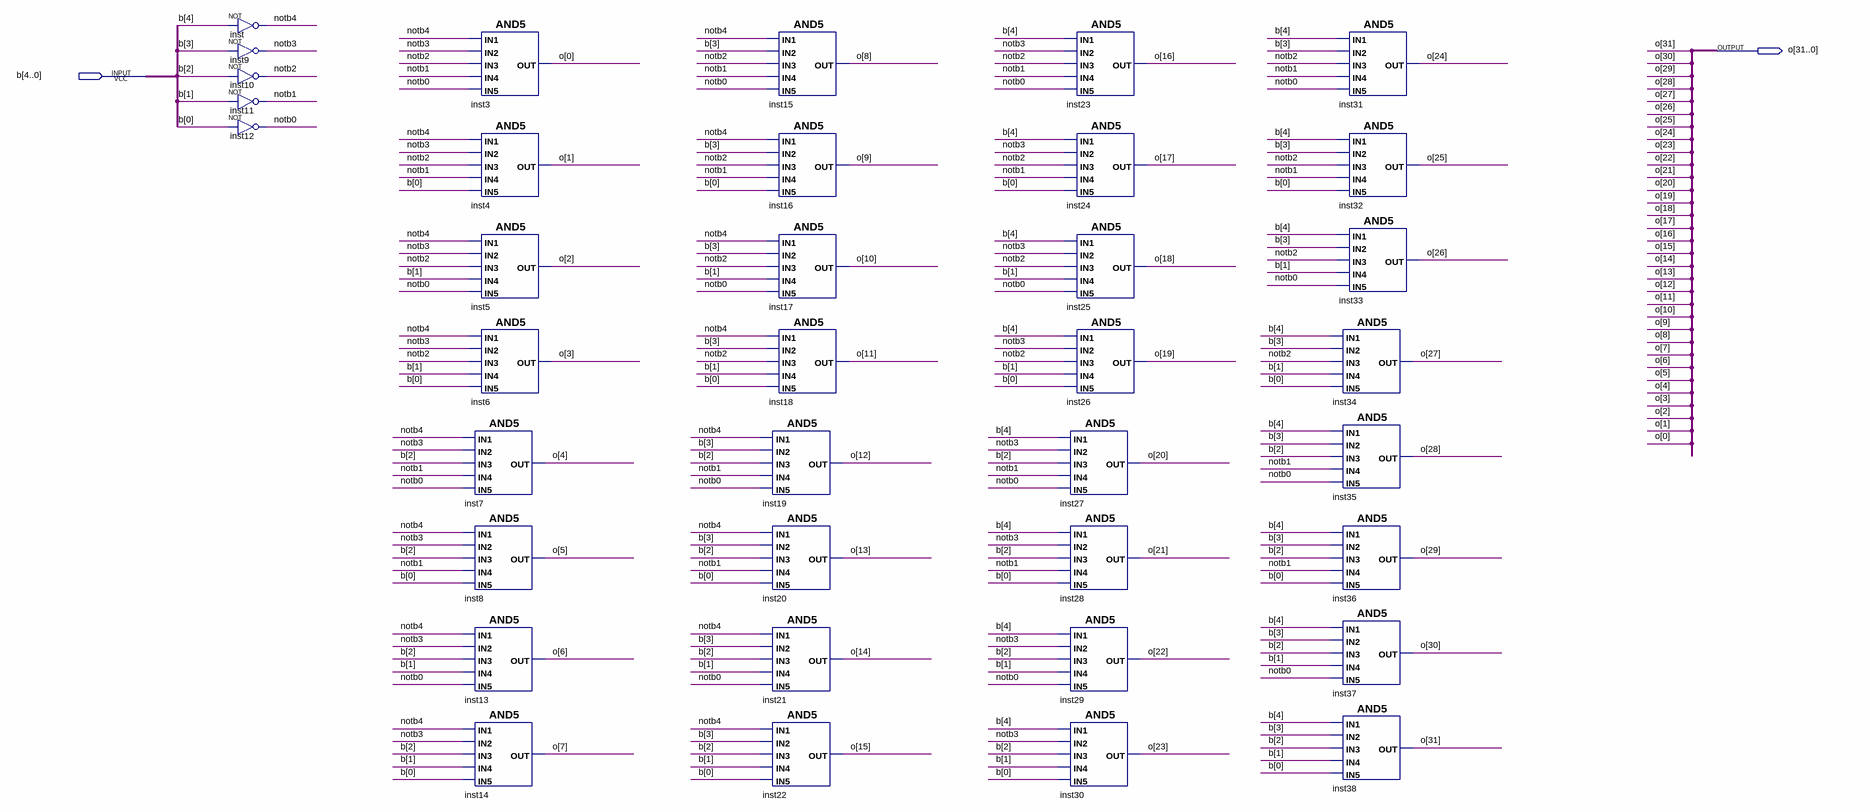
[diagram p0: schematic sheet]
// Quartus schematic decoderRAM(1).bdf as structural Verilog: 37 symbols, 2 pins
module \decoderRAM(1)  (
  input  [4:0] b,
  output [31:0] o
);

  wire notb0, notb1, notb2, notb3, notb4;

  not inst (notb4, b[4]);
  not inst9 (notb3, b[3]);
  not inst10 (notb2, b[2]);
  not inst11 (notb1, b[1]);
  not inst12 (notb0, b[0]);
  and inst3 (o[0], notb4, notb3, notb2, notb1, notb0);
  and inst4 (o[1], notb4, notb3, notb2, notb1, b[0]);
  and inst5 (o[2], notb4, notb3, notb2, b[1], notb0);
  and inst6 (o[3], notb4, notb3, notb2, b[1], b[0]);
  and inst7 (o[4], notb4, notb3, b[2], notb1, notb0);
  and inst8 (o[5], notb4, notb3, b[2], notb1, b[0]);
  and inst13 (o[6], notb4, notb3, b[2], b[1], notb0);
  and inst14 (o[7], notb4, notb3, b[2], b[1], b[0]);
  and inst15 (o[8], notb4, b[3], notb2, notb1, notb0);
  and inst16 (o[9], notb4, b[3], notb2, notb1, b[0]);
  and inst17 (o[10], notb4, b[3], notb2, b[1], notb0);
  and inst18 (o[11], notb4, b[3], notb2, b[1], b[0]);
  and inst19 (o[12], notb4, b[3], b[2], notb1, notb0);
  and inst20 (o[13], notb4, b[3], b[2], notb1, b[0]);
  and inst21 (o[14], notb4, b[3], b[2], b[1], notb0);
  and inst22 (o[15], notb4, b[3], b[2], b[1], b[0]);
  and inst23 (o[16], b[4], notb3, notb2, notb1, notb0);
  and inst24 (o[17], b[4], notb3, notb2, notb1, b[0]);
  and inst25 (o[18], b[4], notb3, notb2, b[1], notb0);
  and inst26 (o[19], b[4], notb3, notb2, b[1], b[0]);
  and inst27 (o[20], b[4], notb3, b[2], notb1, notb0);
  and inst28 (o[21], b[4], notb3, b[2], notb1, b[0]);
  and inst29 (o[22], b[4], notb3, b[2], b[1], notb0);
  and inst30 (o[23], b[4], notb3, b[2], b[1], b[0]);
  and inst31 (o[24], b[4], b[3], notb2, notb1, notb0);
  and inst32 (o[25], b[4], b[3], notb2, notb1, b[0]);
  and inst33 (o[26], b[4], b[3], notb2, b[1], notb0);
  and inst34 (o[27], b[4], b[3], notb2, b[1], b[0]);
  and inst35 (o[28], b[4], b[3], b[2], notb1, notb0);
  and inst36 (o[29], b[4], b[3], b[2], notb1, b[0]);
  and inst37 (o[30], b[4], b[3], b[2], b[1], notb0);
  and inst38 (o[31], b[4], b[3], b[2], b[1], b[0]);
endmodule
